# Altium project spx_project.prjpcb
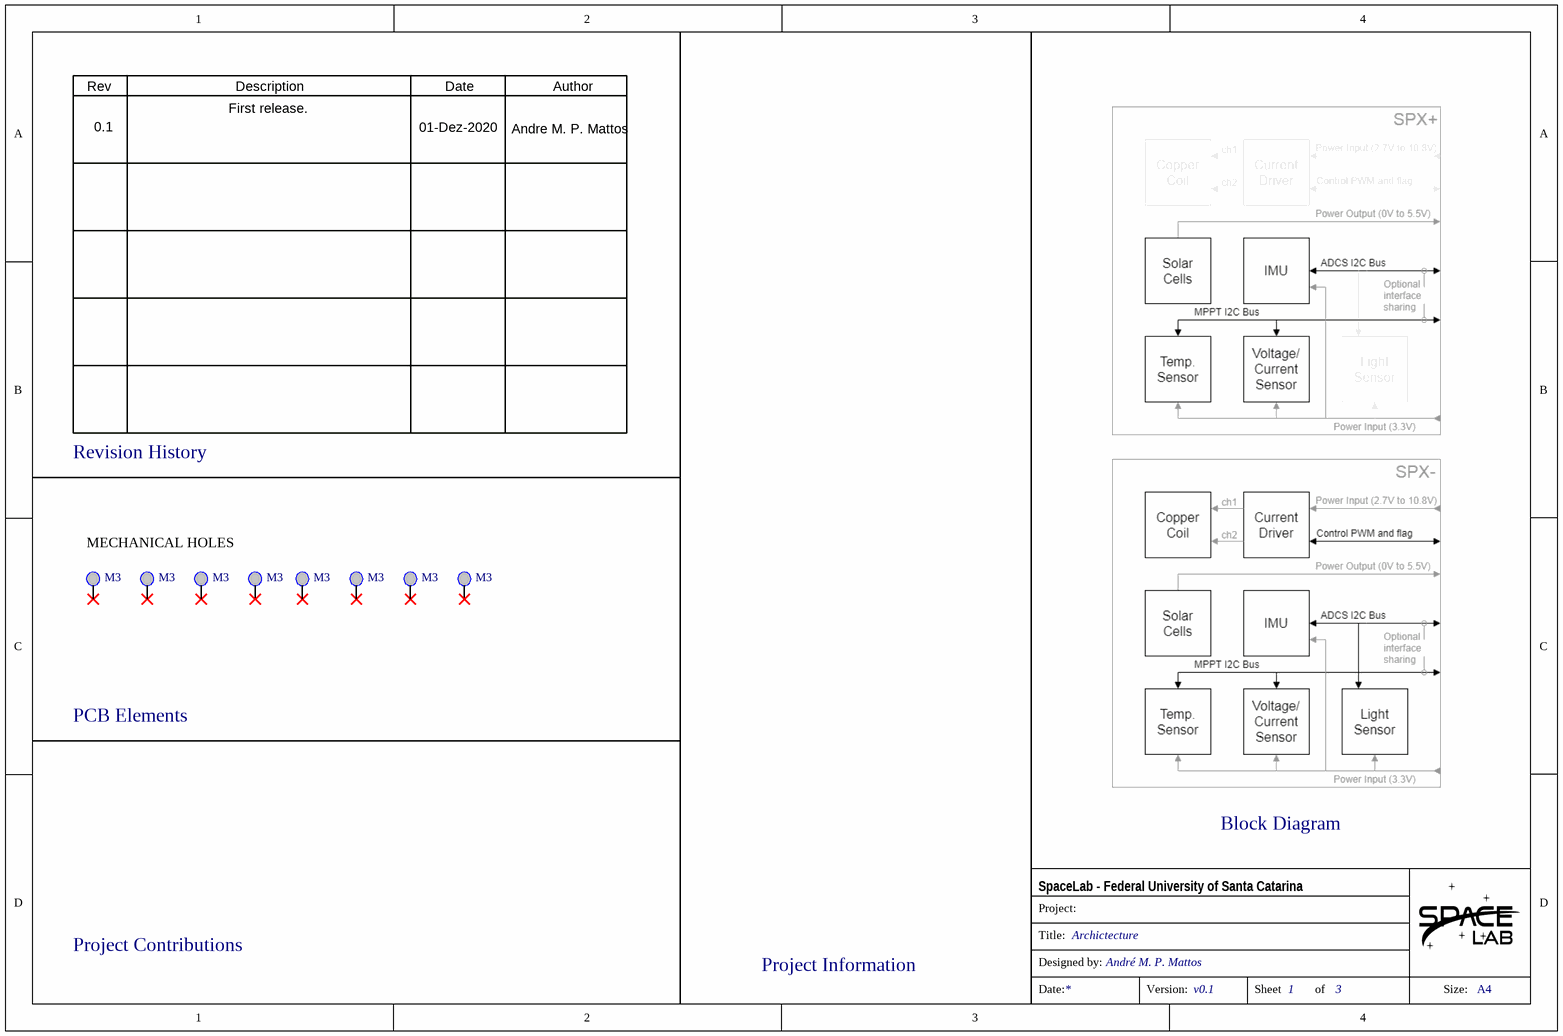
[diagram p0: 0_architecture.schdoc]
DesignedBy: Andre M. P. Mattos; ProductCode: OBDH2; Revision: 0.5
4 sheets, 58 parts. Net scope: global (net labels, ports and power ports of the same name join across sheets).
Board file: board_layout.pcbdoc
Sheets:
  0_architecture.schdoc
  1_interface.schdoc
  2_mppt_circuits.schdoc
  3_adcs_circuits.schdoc

## Sheet 0_architecture.schdoc: Archictecture
size A4; Revision: v0.5; SheetNumber: 1; SheetTotal: 3; Designed by: André M. P. Mattos; Version: v0.1

### Parts
MEC1  M3  [M3 hole]  (no BOM)
MEC2  M3  [M3 hole]  (no BOM)
MEC3  M3  [M3 hole]  (no BOM)
MEC4  M3  [M3 hole]  (no BOM)
MEC5  M3  [M3 hole]  (no BOM)
MEC6  M3  [M3 hole]  (no BOM)
MEC7  M3  [M3 hole]  (no BOM)
MEC8  M3  [M3 hole]  (no BOM)

### Nets

Not connected (* = marked no-connect by the designer): MEC1 0*; MEC2 0*; MEC3 0*; MEC4 0*; MEC5 0*; MEC6 0*; MEC7 0*; MEC8 0*

### Notes on the sheet
- Rev
- Description
- Date
- Author
- 0.1
- First release.
- 01-Dez-2020
- Andre M. P. Mattos
- Revision History
- MECHANICAL HOLES
- PCB Elements
- Block Diagram
- Project Contributions
- Project Information
- Project:
- SpaceLab - Federal University of Santa Catarina
- Title:
- Designed by:
- Date:
- Version:
- Sheet
- of
- Size:
- A4

### Library data of the parts
MEC1-MEC8 = M3 hole

## Sheet 1_interface.schdoc: Solar Cells
size A4; Engineer: Eng_2_ALT; SheetNumber: 2; SheetTotal: 3; Designed by: André M. P. Mattos; Version: v0.1
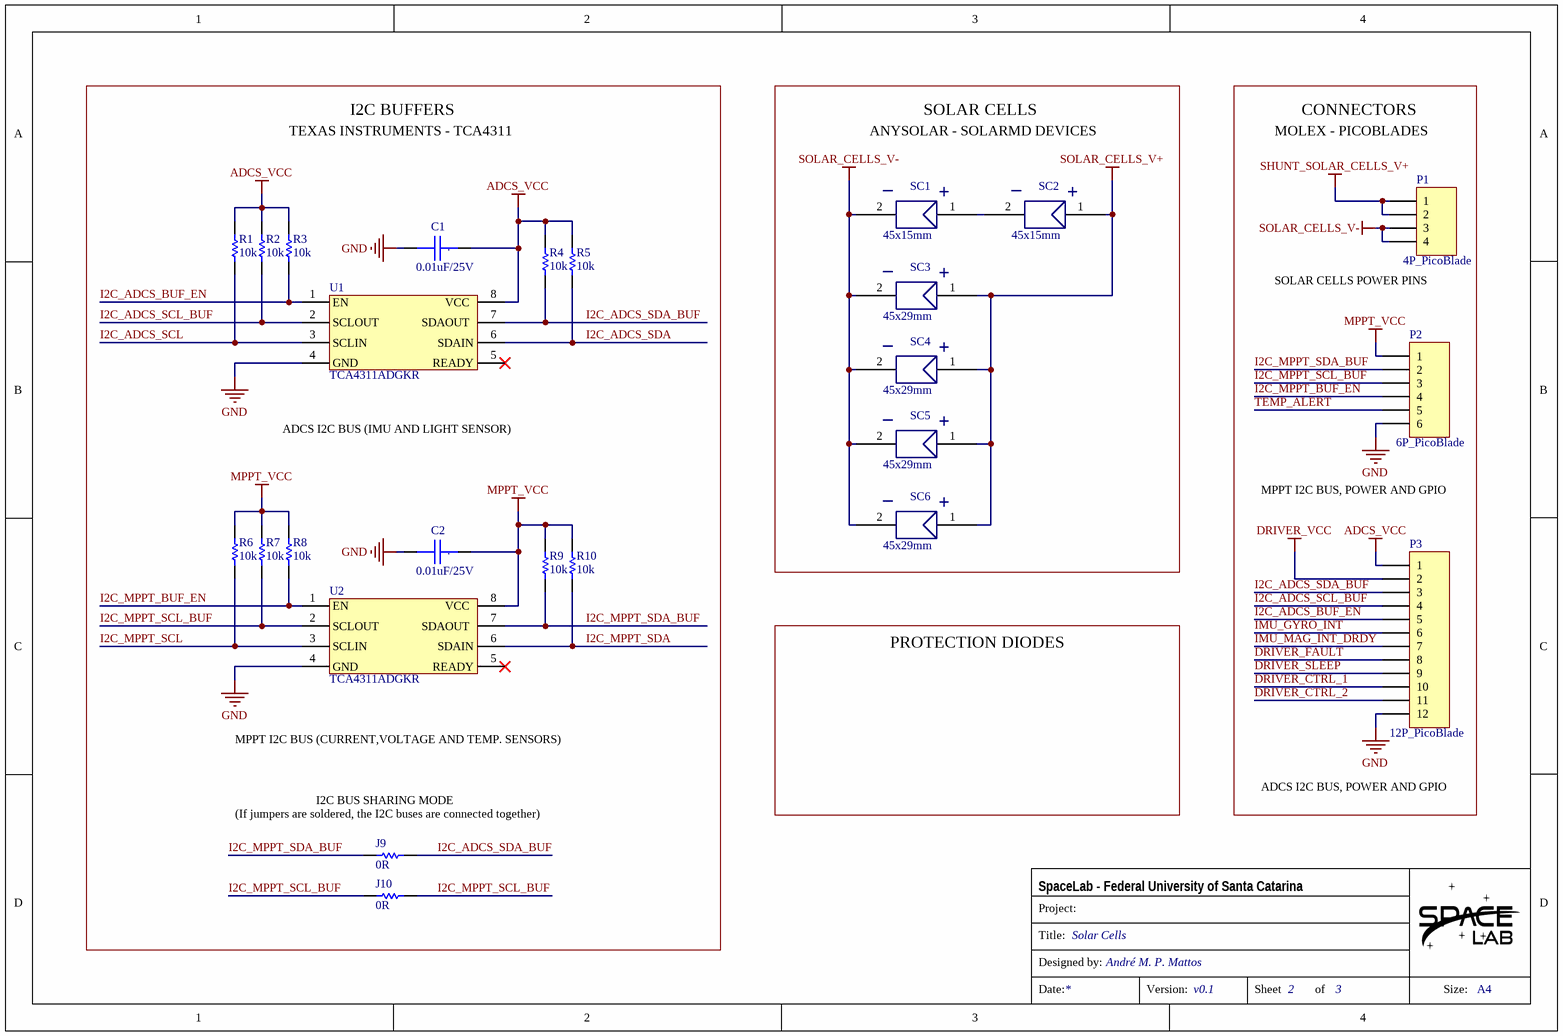
[diagram p1: 1_interface.schdoc]

### Parts
C1  0.01uF/25V  [CC0805]
C2  0.01uF/25V  [CC0805]
J9  0R  [0805]
J10  0R  [0805]
P1  4P_PicoBlade  [HDR4 PicoBlade]
P2  6P_PicoBlade  [HDR6 PicoBlade]
P3  12P_PicoBlade  [HDR12 PicoBlade - duplicate]
R1  10k  [0805]
R2  10k  [0805]
R3  10k  [0805]
R4  10k  [0805]
R5  10k  [0805]
R6  10k  [0805]
R7  10k  [0805]
R8  10k  [0805]
R9  10k  [0805]
R10  10k  [0805]
SC1  size: 45x15mm  [45x15mm_cell]  (hidden comment: SC)
SC2  size: 45x15mm  [45x15mm_cell]  (hidden comment: SC)
SC3  size: 45x29mm  [45x29mm_cell]  (hidden comment: SC)
SC4  size: 45x29mm  [45x29mm_cell]  (hidden comment: SC)
SC5  size: 45x29mm  [45x29mm_cell]  (hidden comment: SC)
SC6  size: 45x29mm  [45x29mm_cell]  (hidden comment: SC)
U1  TCA4311ADGKR  [DGK8]
U2  TCA4311ADGKR  [DGK8]

### Blocks framed on the sheet
I2C BUFFERS: C1 C2 J9 J10 R1-R10 U1 U2
SOLAR CELLS: SC1-SC6
CONNECTORS: P1-P3

### Nets
ADCS_VCC: C1.1 P3.1 R1.2 R2.2 R3.2 R4.2 R5.2 U1.8(VCC)
DRIVER_VCC: P3.2
GND: C1.2 C2.2 P2.6 P3.12 U1.4(GND) U2.4(GND)
MPPT_VCC: C2.1 P2.1 R6.2 R7.2 R8.2 R9.2 R10.2 U2.8(VCC)
SHUNT_SOLAR_CELLS_V+: P1.1 P1.2
SOLAR_CELLS_V+: SC2.1(V+) SC3.1(V+) SC4.1(V+) SC5.1(V+) SC6.1(V+)
SOLAR_CELLS_V-: P1.3 P1.4 SC1.2(V-) SC3.2(V-) SC4.2(V-) SC5.2(V-) SC6.2(V-)
DRIVER_CTRL_1: P3.10
DRIVER_CTRL_2: P3.11
DRIVER_FAULT: P3.8
DRIVER_SLEEP: P3.9
I2C_ADCS_BUF_EN: P3.5 R3.1 U1.1(EN)
I2C_ADCS_SCL: R1.1 U1.3(SCLIN)
I2C_ADCS_SCL_BUF: P3.4 R2.1 U1.2(SCLOUT)
I2C_ADCS_SDA: R5.1 U1.6(SDAIN)
I2C_ADCS_SDA_BUF: J9.1 P3.3 R4.1 U1.7(SDAOUT)
I2C_MPPT_BUF_EN: P2.4 R8.1 U2.1(EN)
I2C_MPPT_SCL: R6.1 U2.3(SCLIN)
I2C_MPPT_SCL_BUF: J10.1 J10.2 P2.3 R7.1 U2.2(SCLOUT)
I2C_MPPT_SDA: R10.1 U2.6(SDAIN)
I2C_MPPT_SDA_BUF: J9.2 P2.2 R9.1 U2.7(SDAOUT)
IMU_GYRO_INT: P3.6
IMU_MAG_INT_DRDY: P3.7
TEMP_ALERT: P2.5
NetSC1_1: SC1.1(V+) SC2.2(V-)

Not connected (* = marked no-connect by the designer): U1 5(READY)*; U2 5(READY)*

### Notes on the sheet
- TEXAS INSTRUMENTS - TCA4311
- ANYSOLAR - SOLARMD DEVICES
- MOLEX - PICOBLADES
- (near P1) SOLAR CELLS POWER PINS
- ADCS I2C BUS (IMU AND LIGHT SENSOR)
- MPPT I2C BUS, POWER AND GPIO
- PROTECTION DIODES
- MPPT I2C BUS (CURRENT,VOLTAGE AND TEMP. SENSORS)
- ADCS I2C BUS, POWER AND GPIO
- (near J9) (If jumpers are soldered, the I2C buses are connected together)
- (near J9) I2C BUS SHARING MODE
- Project:
- SpaceLab - Federal University of Santa Catarina
- Title:
- Designed by:
- Date:
- Version:
- Sheet
- of
- Size:
- A4
- (in symbol Cap_Cer_X7R_0.01uF_50V_0805) .
- (in symbol solar_cell_sm141k04lv) _; +
- (in symbol solar_cell_sm141k08lv) _; +

### Library data of the parts
C1 C2 = Cap_Cer_X7R_0.01uF_50V_0805: CAP CER 0.01uF 25V 10% X7R 0805; Partnumber: CL21B103KAANNNC; NCM: 8532.24.10
J9 J10 = R0R_JUMPER_1/16W_0805: RES 0R OHM 1/16W JUMPER 0805; Partnumber: CRCW08050000Z0EA; NCM: 8533.21.20
P1 = Header 4_PicoBlade: Header, 4-Pin; PartNumber: 53398-0471; Manufacturer: Molex; Body Plating: Tin; Number of Positions: 4; Gender: Male; Current Rating: 1A; Voltage Rating: 125V; Contact Resistance: 20mR; Insulation Resistance: 100MR; Pitch: 1.25mm; Glow Wire Compliant: Non-compliant; LatestRevisionDate: 17-Jul-2002; LatestRevisionNote: Re-released for DXP Platform.; Publisher: Altium Limited; Supplier 1: Mouser; Supplier Part Number 1: 538-53398-0471; Stock 1: 43251; Pricing 1: 1=0.98, 10=0.832, 100=0.716, 500=0.6, 1000=0.391, 2000=0.342 (USD); Mount: Surface Mount; Contact Plating: Tin; Contact Material: Bronze,Tin,Brass; Color: Natural; Housing Material: Nylon; Housing Color: Natural; Min Operating Temperature: -40°C; Max Operating Temperature: 85°C; Termination: Solder; Number of Rows: 1; Packaging: Tape and Reel; Number of Contacts: 4; Orientation: Vertical; Package Quantity: 1000; Number of Circuits: 4; Voltage Rating (AC): 125V; Working Voltage: 125V; Voltage Rating (DC): 125V; Lead Pitch: 1.25mm; Radiation Hardening: No; REACH SVHC: Unknown; Lead Free: Lead Free; Flammability Rating: UL94 V-0; ComponentLink1URL: http://www.mouser.com/ds/2/276/0533980471_PCB_HEADERS-171069.pdf?src-supplier=Mouser; ComponentLink1Description: http://www.mouser.com/ds/2/276/0533980471_PCB_HEADERS-171069.pdf?src-supplier=Mouser; ComponentLink2URL: http://www.jameco.com/Jameco/Products/ProdDS/1932627.pdf?src-supplier=Jameco; ComponentLink2Description: http://www.jameco.com/Jameco/Products/ProdDS/1932627.pdf?src-supplier=Jameco; ComponentLink3URL: https://www.distrelec.biz/Web/Downloads/46/_e/gf116833-116846_e.pdf?mime=application%2Fpdf&src-supplier=Distrelec; ComponentLink3Description: https://www.distrelec.biz/Web/Downloads/46/_e/gf116833-116846_e.pdf?mime=application%2Fpdf&src-supplier=Distrelec; ComponentLink4URL: http://www.molex.com/webdocs/datasheets/pdf/en-us/0533980471_PCB_HEADERS.pdf?src-supplier=Element14; ComponentLink4Description: http://www.molex.com/webdocs/datasheets/pdf/en-us/0533980471_PCB_HEADERS.pdf?src-supplier=Element14; ComponentLink5URL: http://www.farnell.com/datasheets/1867381.pdf?src-supplier=Element14; ComponentLink5Description: http://www.farnell.com/datasheets/1867381.pdf?src-supplier=Element14; ComponentLink6URL: http://uk.rs-online.com/webdocs/13c4/0900766b813c4500.pdf?src-supplier=RSComponents; ComponentLink6Description: http://uk.rs-online.com/webdocs/13c4/0900766b813c4500.pdf?src-supplier=RSComponents; ComponentLink7URL: http://www.molex.com/webdocs/datasheets/pdf/en-us/0533980471_PCB_HEADERS.pdf?src-supplier=Farnell; ComponentLink7Description: http://www.molex.com/webdocs/datasheets/pdf/en-us/0533980471_PCB_HEADERS.pdf?src-supplier=Farnell; ComponentLink8URL: http://www.farnell.com/datasheets/2697809.pdf?src-supplier=Element14; ComponentLink8Description: http://www.farnell.com/datasheets/2697809.pdf?src-supplier=Element14; ComponentLink9URL: http://www.molex.com/webdocs/datasheets/pdf/en-us/0533980471_PCB_HEADERS.pdf?src-supplier=Avnet; ComponentLink9Description: http://www.molex.com/webdocs/datasheets/pdf/en-us/0533980471_PCB_HEADERS.pdf?src-supplier=Avnet; ComponentLink10URL: http://www.molex.com/webdocs/datasheets/pdf/en-us/0533980471_PCB_HEADERS.pdf?src-supplier=Avnet+Europe; ComponentLink10Description: http://www.molex.com/webdocs/datasheets/pdf/en-us/0533980471_PCB_HEADERS.pdf?src-supplier=Avnet+Europe; Supplier 2: Digi-Key; Supplier Part Number 2: WM7608CT-ND; Stock 2: 20817; Pricing 2: 1=1.19, 10=1.044, 100=0.901, 500=0.73716 (USD); Manufacturer Part Number: 53398-0471
P2 = Header 6H_PicoBlade: Header, 6-Pin, Right Angle; Partnumber: 53398-0671; LatestRevisionDate: 17-Jul-2002; LatestRevisionNote: Re-released for DXP Platform.; Publisher: Altium Limited
P3 = Header 12_PicoBlade: Header, 12-Pin; PartNumber: 53398-1271; LatestRevisionDate: 17-Jul-2002; LatestRevisionNote: Re-released for DXP Platform.; Publisher: Altium Limited
R1-R10 = R10k_1%_1/8W_0805: RES 10K OHM 1/8W 1%  0805; Partnumber: CRCW080510K0FKEA; NCM: 8533.21.20
SC1 SC2 = solar_cell_sm141k04lv: sm141k04lv; partnumber: sm141k04lv; Part Number: sm141k04lv
SC3-SC6 = solar_cell_sm141k08lv: sm141k08lv; partnumber: sm141k08lv; Part Number: sm141k08lv
U1 U2 = TCA4311ADGKR: IC SIGNAL BUFFER I2C VSSOP-8; Partnumber: TCA4311ADGKR

## Sheet 2_mppt_circuits.schdoc: Power Circuits
size A4; Engineer: Eng_2_ALT; SheetNumber: 3; SheetTotal: 3; Designed by: André M. P. Mattos; Version: v0.1
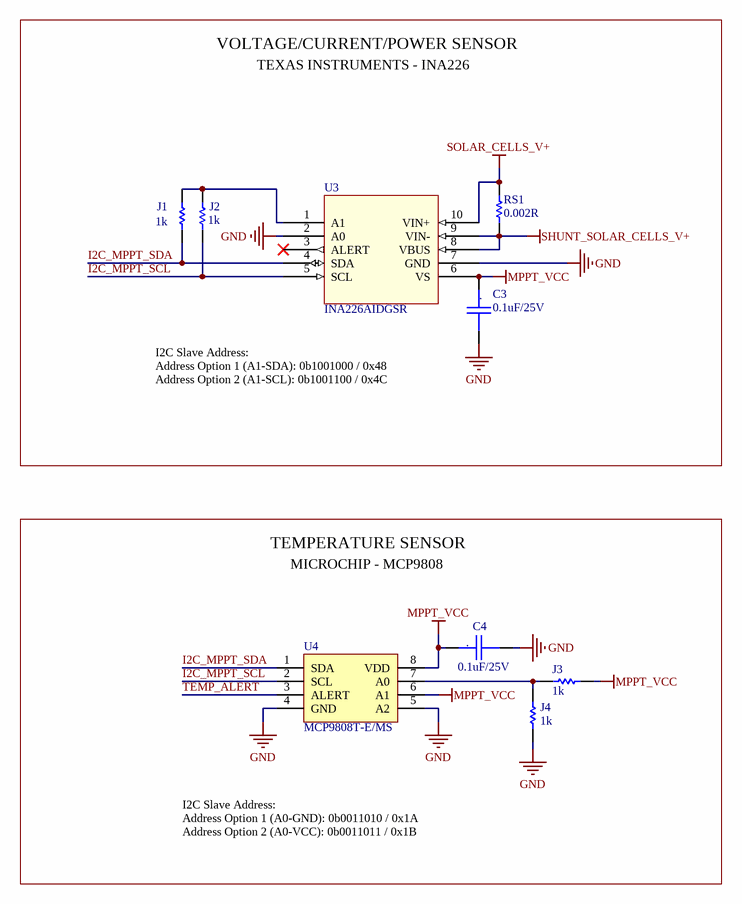
[diagram p2: 2_mppt_circuits.schdoc]

### Parts
C3  0.1uF/25V  [CC0805]
C4  0.1uF/25V  [CC0805]
J1  1k  [0805]
J2  1k  [0805]
J3  1k  [0805]
J4  1k  [0805]
RS1  0.002R  [0805]
U3  INA226AIDGSR  [DGS10]
U4  MCP9808T-E/MS  [MSOP-8]

### Blocks framed on the sheet
VOLTAGE/CURRENT/POWER SENSOR: C3 J1 J2 RS1 U3
TEMPERATURE SENSOR: C4 J3 J4 U4

### Nets
GND: C3.2 C4.2 J4.1 U3.2(A0) U3.7(GND) U4.4(GND) U4.5(A2)
MPPT_VCC: C3.1 C4.1 J3.1 U3.6(VS) U4.6(A1) U4.8(VDD)
SHUNT_SOLAR_CELLS_V+: RS1.1 U3.8(VBUS) U3.9(VIN-)
SOLAR_CELLS_V+: RS1.2 U3.10(VIN+)
I2C_MPPT_SCL: J2.1 U3.5(SCL) U4.2(SCL)
I2C_MPPT_SDA: J1.1 U3.4(SDA) U4.1(SDA)
TEMP_ALERT: U4.3(ALERT)
NetJ1_2: J1.2 J2.2 U3.1(A1)
NetJ3_2: J3.2 J4.2 U4.7(A0)

Not connected (* = marked no-connect by the designer): U3 3(ALERT)*

### Notes on the sheet
- TEXAS INSTRUMENTS - INA226
- I2C Slave Address:
  Address Option 1 (A1-SDA): 0b1001000 / 0x48
  Address Option 2 (A1-SCL): 0b1001100 / 0x4C
- MICROCHIP - MCP9808
- I2C Slave Address:
  Address Option 1 (A0-GND): 0b0011010 / 0x1A
  Address Option 2 (A0-VCC): 0b0011011 / 0x1B
- Project:
- SpaceLab - Federal University of Santa Catarina
- Title:
- Designed by:
- Date:
- Version:
- Sheet
- of
- Size:
- A4
- (in symbol Cap_Cer_X7R_0.1uF_25V_0805) .

### Library data of the parts
C3 C4 = Cap_Cer_X7R_0.1uF_25V_0805: CAP CER 0.1UF 25V 10% X7R 0805; Partnumber: CC0805KRX7R8BB104; NCM: 8532.24.10
J1-J4 = R1.0k_1%_1/8W_0805: RES 1.0K OHM 1/8W 1% 0805; Partnumber: RC0805FR-071KL; NCM: 8533.21.20
RS1 = R0.002R_3%_0.5W_0805: Current Sense Resistors - SMD 0.002 ohm 3% 0.5W Current Sense; Partnumber: LVT08R0020HER
U3 = INA226AIDGSR: High-Side Measurement, Bi-Directional Current/Power Monitor w/I2C Interface; Manufacturer: Texas Instruments; GENERIC_PART_NUMBER: INA226; INDUSTRY_STD_PKG_TYPE: MSOP; FAMILY_NAME: CURRENT SHUNT MONITOR; PIN_COUNT: 10; PACKAGE_DESIGNATOR: DGS; Datasheet_URL: http://www.ti.com/lit/gpn/INA226; Vendor: Texas Instruments; Manufacturer_Part_Number: INA226AIDGSR; Copyright: Copyright (C) 2018 Accelerated Designs. All rights reserved; RefDes: RefDes; Type: DEV
U4 = MCP9808: Partnumber: MCP9808T-E/MS

## Sheet 3_adcs_circuits.schdoc: Power Circuits
size A4; Engineer: Eng_2_ALT; SheetNumber: 3; SheetTotal: 3; Designed by: André M. P. Mattos; Version: v0.1
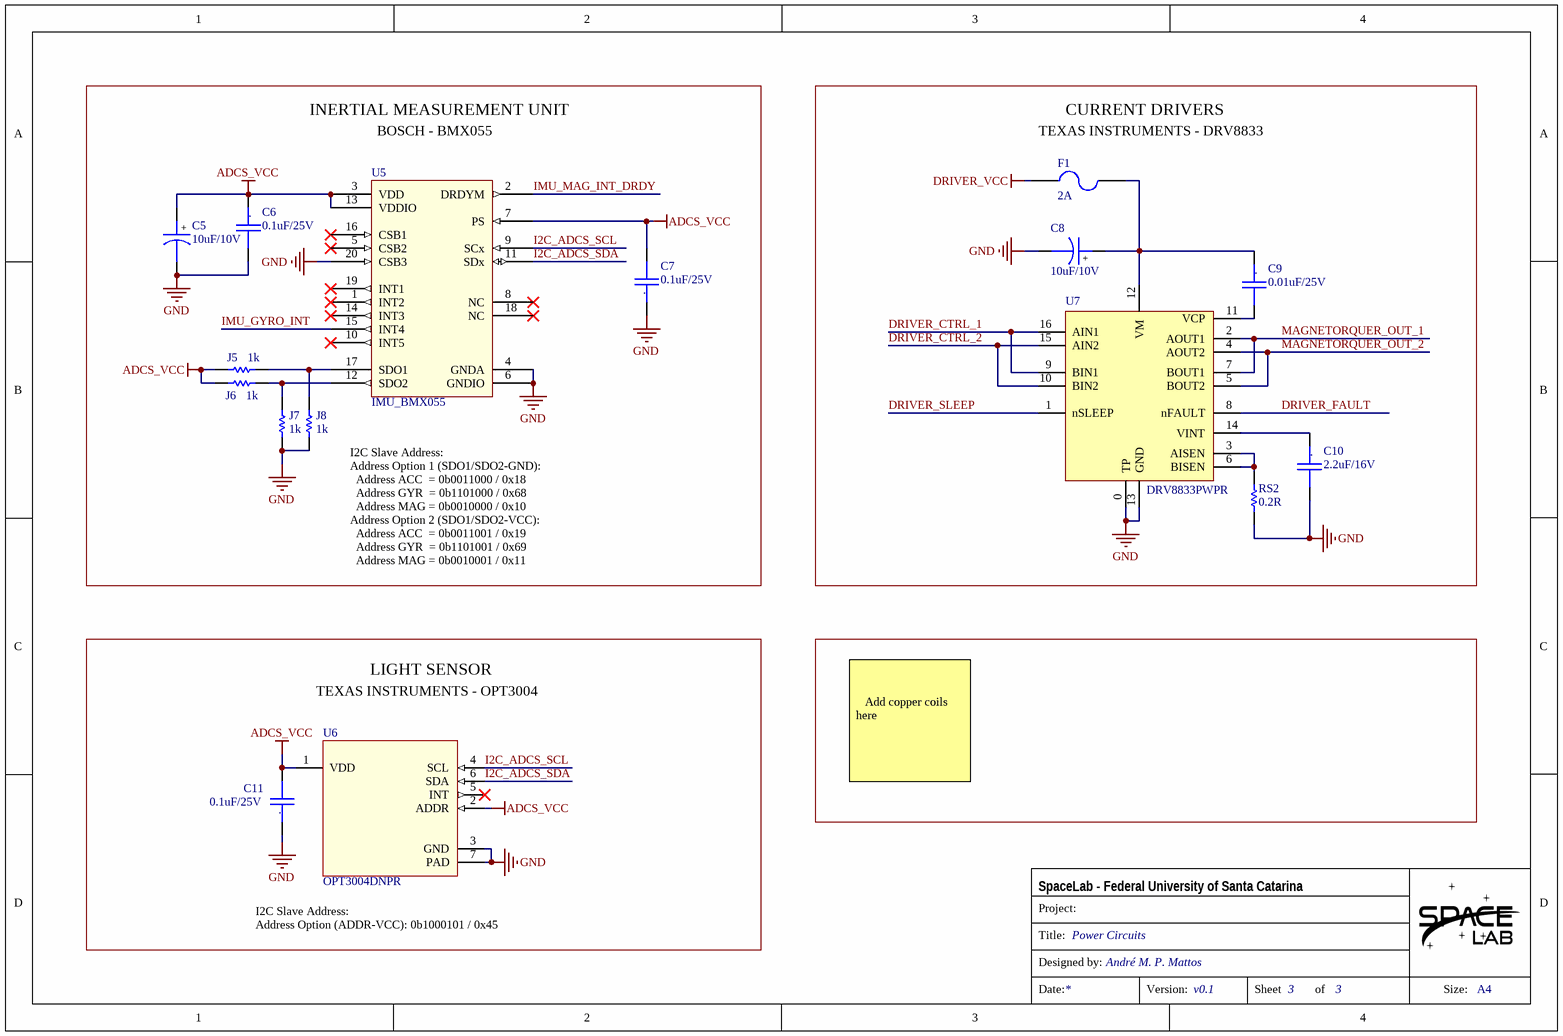
[diagram p3: 3_adcs_circuits.schdoc]

### Parts
C5  10uF/10V  [CC0805_Tantalum]
C6  0.1uF/25V  [CC0805]
C7  0.1uF/25V  [CC0805]
C8  10uF/10V  [CC0805_Tantalum]
C9  0.01uF/25V  [CC0805]
C10  2.2uF/16V  [CC0805]
C11  0.1uF/25V  [CC0805]
F1  2A  [1206]
J5  1k  [0805]
J6  1k  [0805]
J7  1k  [0805]
J8  1k  [0805]
RS2  0.2R  [0805]
U5  IMU_BMX055  [LGA20]
U6  OPT3004DNPR  [DNP0006A]
U7  DRV8833PWPR  [16TTSSOP]

### Blocks framed on the sheet
INERTIAL MEASUREMENT UNIT: C5-C7 J5-J8 U5
CURRENT DRIVERS: C8-C10 F1 RS2 U7
LIGHT SENSOR: C11 U6

### Nets
ADCS_VCC: C5.1 C6.1 C7.2 C11.2 J5.2 J6.2 U5.3(VDD) U5.7(PS) U5.13(VDDIO) U6.1(VDD) U6.2(ADDR)
DRIVER_VCC: F1.2
GND: C5.2 C6.2 C7.1 C8.2 C10.2 C11.1 J7.1 J8.1 RS2.1 U5.4(GNDA) U5.6(GNDIO) U5.20(CSB3) U6.3(GND) U6.7(PAD) U7.0(TP) U7.13(GND)
DRIVER_CTRL_1: U7.9(BIN1) U7.16(AIN1)
DRIVER_CTRL_2: U7.10(BIN2) U7.15(AIN2)
DRIVER_FAULT: U7.8(nFAULT)
DRIVER_SLEEP: U7.1(nSLEEP)
I2C_ADCS_SCL: U5.9(SCx) U6.4(SCL)
I2C_ADCS_SDA: U5.11(SDx) U6.6(SDA)
IMU_GYRO_INT: U5.15(INT4)
IMU_MAG_INT_DRDY: U5.2(DRDYM)
MAGNETORQUER_OUT_1: U7.2(AOUT1) U7.7(BOUT1)
MAGNETORQUER_OUT_2: U7.4(AOUT2) U7.5(BOUT2)
NetC8_1: C8.1 C9.1 F1.1 U7.12(VM)
NetC9_2: C9.2 U7.11(VCP)
NetC10_1: C10.1 U7.14(VINT)
NetJ5_1: J5.1 J8.2 U5.17(SDO1)
NetJ6_1: J6.1 J7.2 U5.12(SDO2)
NetRS2_2: RS2.2 U7.3(AISEN) U7.6(BISEN)

Not connected (* = marked no-connect by the designer): U5 1(INT2)* 5(CSB2)* 8(NC)* 10(INT5)* 14(INT3)* 16(CSB1)* 18(NC)* 19(INT1)*; U6 5(INT)*

### Notes on the sheet
- BOSCH - BMX055
- (near F1) TEXAS INSTRUMENTS - DRV8833
- I2C Slave Address:
  Address Option 1 (SDO1/SDO2-GND):
  Address ACC  = 0b0011000 / 0x18
  Address GYR  = 0b1101000 / 0x68
  Address MAG = 0b0010000 / 0x10
  Address Option 2 (SDO1/SDO2-VCC):
  Address ACC  = 0b0011001 / 0x19
  Address GYR  = 0b1101001 / 0x69
  Address MAG = 0b0010001 / 0x11
- TEXAS INSTRUMENTS - OPT3004
- Add copper coils here
- (near U6) I2C Slave Address:
  Address Option (ADDR-VCC): 0b1000101 / 0x45
- Project:
- SpaceLab - Federal University of Santa Catarina
- Title:
- Designed by:
- Date:
- Version:
- Sheet
- of
- Size:
- A4
- (in symbol Cap_Cer_X7R_0.1uF_25V_0805) .
- (in symbol Cap_Cer_X7R_0.01uF_50V_0805) .
- (in symbol Cap_Cer_X7R_2.2uF_16V_0805) .
- (in symbol Cap_Tant_SMD_10uF_10V_0805) +

### Library data of the parts
C5 C8 = Cap_Tant_SMD_10uF_10V_0805: CAP Tantalum 10uF 10V 20% 0805; Partnumber: TPSP106M010R2000; NCM: 8532.21.11
C6 C7 C11 = Cap_Cer_X7R_0.1uF_25V_0805: as C3 on sheet 2_mppt_circuits; NCM: 8532.24.10
C9 = Cap_Cer_X7R_0.01uF_50V_0805: as C1 on sheet 1_interface; NCM: 8532.24.10
C10 = Cap_Cer_X7R_2.2uF_16V_0805: CAP CER 2.2uF 16V 10% X7R 0805; Partnumber: EMF212B7225KGHT
F1 = Fuse: Surface Mount Fuses SMD 1206 Fast Action 2A; PartNumber: SF-1206FP200-2
J5-J8 = R1.0k_1%_1/8W_0805: as J1 on sheet 2_mppt_circuits; NCM: 8533.21.20
RS2 = R0.2_1%_1/4W_0805: RES 0.2R OHM 1/4W 1% 0805; Partnumber: ERJ-U6SFR20V; NCM: 8533.21.20
U6 = OPT3004DNPR: No Description Available; Manufacturer: Texas Instruments; PartNumber: OPT3004DNPR; RefDes: RefDes; Type: DEV; Value: Value; Copyright: Copyright (C) 2018 Accelerated Designs. All rights reserved
U7 = DRV8833PWPR: Partnumber: DRV8833PWPR

## Nets that join several sheets
ADCS_VCC: 1_interface (8 pins), 3_adcs_circuits (11 pins)
DRIVER_VCC: 1_interface (P3.2), 3_adcs_circuits (F1.2)
GND: 1_interface (6 pins), 2_mppt_circuits (7 pins), 3_adcs_circuits (16 pins)
MPPT_VCC: 1_interface (8 pins), 2_mppt_circuits (6 pins)
SHUNT_SOLAR_CELLS_V+: 1_interface (P1.1 P1.2), 2_mppt_circuits (RS1.1 U3.8 U3.9)
SOLAR_CELLS_V+: 1_interface (5 pins), 2_mppt_circuits (RS1.2 U3.10)
DRIVER_CTRL_1: 1_interface (P3.10), 3_adcs_circuits (U7.9 U7.16)
DRIVER_CTRL_2: 1_interface (P3.11), 3_adcs_circuits (U7.10 U7.15)
DRIVER_FAULT: 1_interface (P3.8), 3_adcs_circuits (U7.8)
DRIVER_SLEEP: 1_interface (P3.9), 3_adcs_circuits (U7.1)
I2C_ADCS_SCL: 1_interface (R1.1 U1.3), 3_adcs_circuits (U5.9 U6.4)
I2C_ADCS_SDA: 1_interface (R5.1 U1.6), 3_adcs_circuits (U5.11 U6.6)
I2C_MPPT_SCL: 1_interface (R6.1 U2.3), 2_mppt_circuits (J2.1 U3.5 U4.2)
I2C_MPPT_SDA: 1_interface (R10.1 U2.6), 2_mppt_circuits (J1.1 U3.4 U4.1)
IMU_GYRO_INT: 1_interface (P3.6), 3_adcs_circuits (U5.15)
IMU_MAG_INT_DRDY: 1_interface (P3.7), 3_adcs_circuits (U5.2)
TEMP_ALERT: 1_interface (P2.5), 2_mppt_circuits (U4.3)

## Assembly variants
dnp_variant: not fitted D1 D2 D3 D4 D5 D6 D7 D8 J_PC1 J_PC2 J_PC3 J_PC4 J_PC5 J_PC6 J_PC7 J_PC8 J_PC9 J_PC10 J_PC11 J_V3 P2 P5 P6 P7 P8 R38